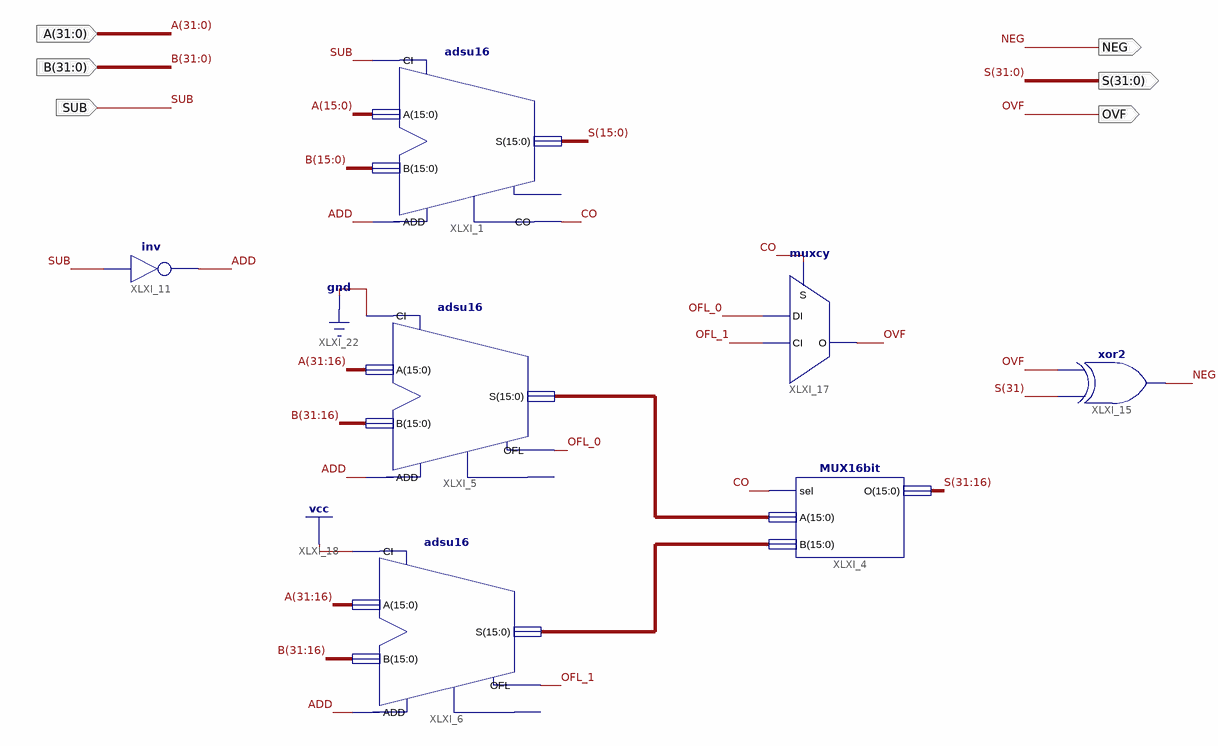
[diagram p0: schematic sheet 1]
// Xilinx ISE schematic ADD_SUB_32b.sch (spartan6) as structural Verilog: 7 symbols, 6 ports
module ADD_SUB_32b (
  input  SUB,
  input  [31:0] B,
  input  [31:0] A,
  output NEG,
  output OVF,
  output [31:0] S
);

  wire ADD, CO, OFL_0, OFL_1;
  wire [15:0] XLXN_19, XLXN_26;

  adsu16 XLXI_1 (.A(A[15:0]), .ADD(ADD), .B(B[15:0]), .CI(SUB), .CO(CO), .S(S[15:0]));  // open: OFL
  adsu16 XLXI_5 (.A(A[31:16]), .ADD(ADD), .B(B[31:16]), .CI(1'b0), .OFL(OFL_0), .S(XLXN_26));  // open: CO
  adsu16 XLXI_6 (.A(A[31:16]), .ADD(ADD), .B(B[31:16]), .CI(1'b1), .OFL(OFL_1), .S(XLXN_19));  // open: CO
  not XLXI_11 (ADD, SUB);
  MUX16bit XLXI_4 (.sel(CO), .A(XLXN_26), .B(XLXN_19), .O(S[31:16]));
  xor XLXI_15 (NEG, S[31], OVF);
  muxcy XLXI_17 (.CI(OFL_1), .DI(OFL_0), .S(CO), .O(OVF));
endmodule
